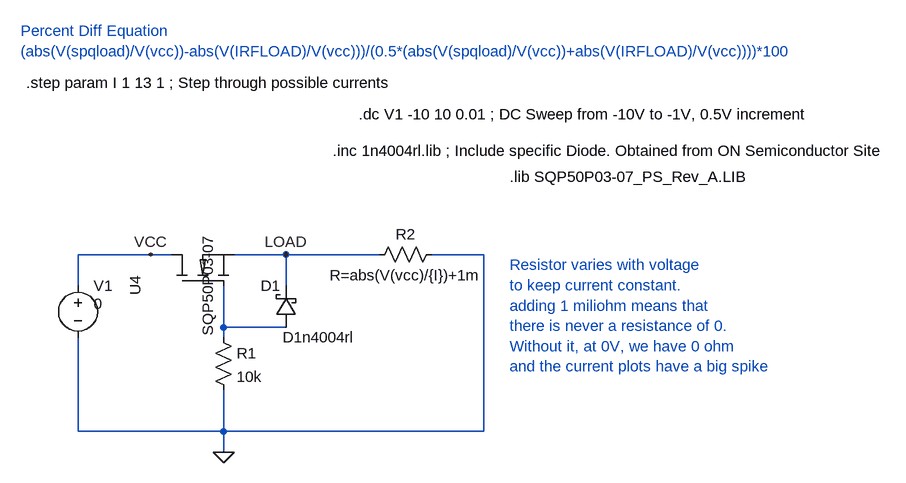
[diagram p0: schematic Reverse Voltage Protection.asc]
Reverse Voltage Protection.asc, the LTspice schematic file:
Version 4
SHEET 1 3300 852
WIRE 144 -16 32 -16
WIRE 176 -16 144 -16
WIRE 352 -16 272 -16
WIRE 496 -16 352 -16
WIRE 656 -16 576 -16
WIRE 32 32 32 -16
WIRE 352 32 352 -16
WIRE 256 96 256 32
WIRE 352 96 256 96
WIRE 256 112 256 96
WIRE 32 256 32 112
WIRE 256 256 256 192
WIRE 256 256 32 256
WIRE 656 256 656 -16
WIRE 656 256 256 256
WIRE 256 288 256 256
FLAG 256 288 0
FLAG 352 -16 LOAD
FLAG 144 -16 VCC
SYMBOL res 480 0 R270
WINDOW 0 32 56 VTop 2
WINDOW 3 0 56 VBottom 2
SYMATTR InstName R2
SYMATTR Value R=abs(V(vcc)/{I})+1m
SYMBOL res 240 96 R0
SYMATTR InstName R1
SYMATTR Value 10k
SYMBOL schottky 368 96 R180
WINDOW 0 24 64 Left 2
WINDOW 3 -91 -15 Left 2
SYMATTR InstName D1
SYMATTR Value D1n4004rl
SYMATTR Description Zener Diode
SYMATTR Type zener
SYMBOL SQP50P03-07 176 32 R270
SYMATTR InstName U4
SYMBOL voltage 32 16 R0
WINDOW 123 0 0 Left 0
WINDOW 39 0 0 Left 0
WINDOW 3 24 44 Left 2
SYMATTR Value 0
SYMATTR InstName V1
TEXT -48 -280 Left 2 !.step param I 1 13 1 ; Step through possible currents
TEXT -56 -360 Left 2 ;Percent Diff Equation\n(abs(V(spqload)/V(vcc))-abs(V(IRFLOAD)/V(vcc)))/(0.5*(abs(V(spqload)/V(vcc))+abs(V(IRFLOAD)/V(vcc))))*100
TEXT 696 0 Left 2 ;Resistor varies with voltage\nto keep current constant. \nadding 1 miliohm means that\nthere is never a resistance of 0. \nWithout it, at 0V, we have 0 ohm\nand the current plots have a big spike
TEXT 696 -136 Left 2 !.lib SQP50P03-07_PS_Rev_A.LIB
TEXT 424 -176 Left 2 !.inc 1n4004rl.lib ; Include specific Diode. Obtained from ON Semiconductor Site
TEXT 464 -232 Left 2 !.dc V1 -10 10 0.01 ; DC Sweep from -10V to -1V, 0.5V increment

The netlist it stands for:
* Reverse Voltage Protection.asc
R2 LOAD 0 R=abs(V(vcc)/{I})+1m
R1 N001 0 10k
D1 N001 LOAD D1n4004rl
XU4 VCC N001 LOAD SQP50P03-07  ; pins D G S
V1 VCC 0 0
.model D D
.lib standard.dio
.step param I 1 13 1 ; Step through possible currents
* Percent Diff Equation
* (abs(V(spqload)/V(vcc))-abs(V(IRFLOAD)/V(vcc)))/(0.5*(abs(V(spqload)/V(vcc))+abs(V(IRFLOAD)/V(vcc))))*100
* Resistor varies with voltage
* to keep current constant.
* adding 1 miliohm means that
* there is never a resistance of 0.
* Without it, at 0V, we have 0 ohm
* and the current plots have a big spike
.lib SQP50P03-07_PS_Rev_A.LIB
.inc 1n4004rl.lib ; Include specific Diode. Obtained from ON Semiconductor Site
.dc V1 -10 10 0.01 ; DC Sweep from -10V to -1V, 0.5V increment
.lib D:\Desktop\Capstone\Circuit-Board\Simulations\LTspice\SQP50P03-07_PS_Rev_A.LIB
.backanno
.end